# Altium schematic sheet 01_MPPT_controller.SchDoc
size 420 x 297 mm; Author: Shpakov Dmitry; Address1: Address1; Address2: Address2; Address3: Address3; Address4: Address4; DocumentNumber: АБВГ.123456.001 Э3; SheetNumber: 2; SheetTotal: 13; Scale: 1:1; DocumentType: Схема электрическая принципиальная; FirstReferrence: АБВГ.123456.001
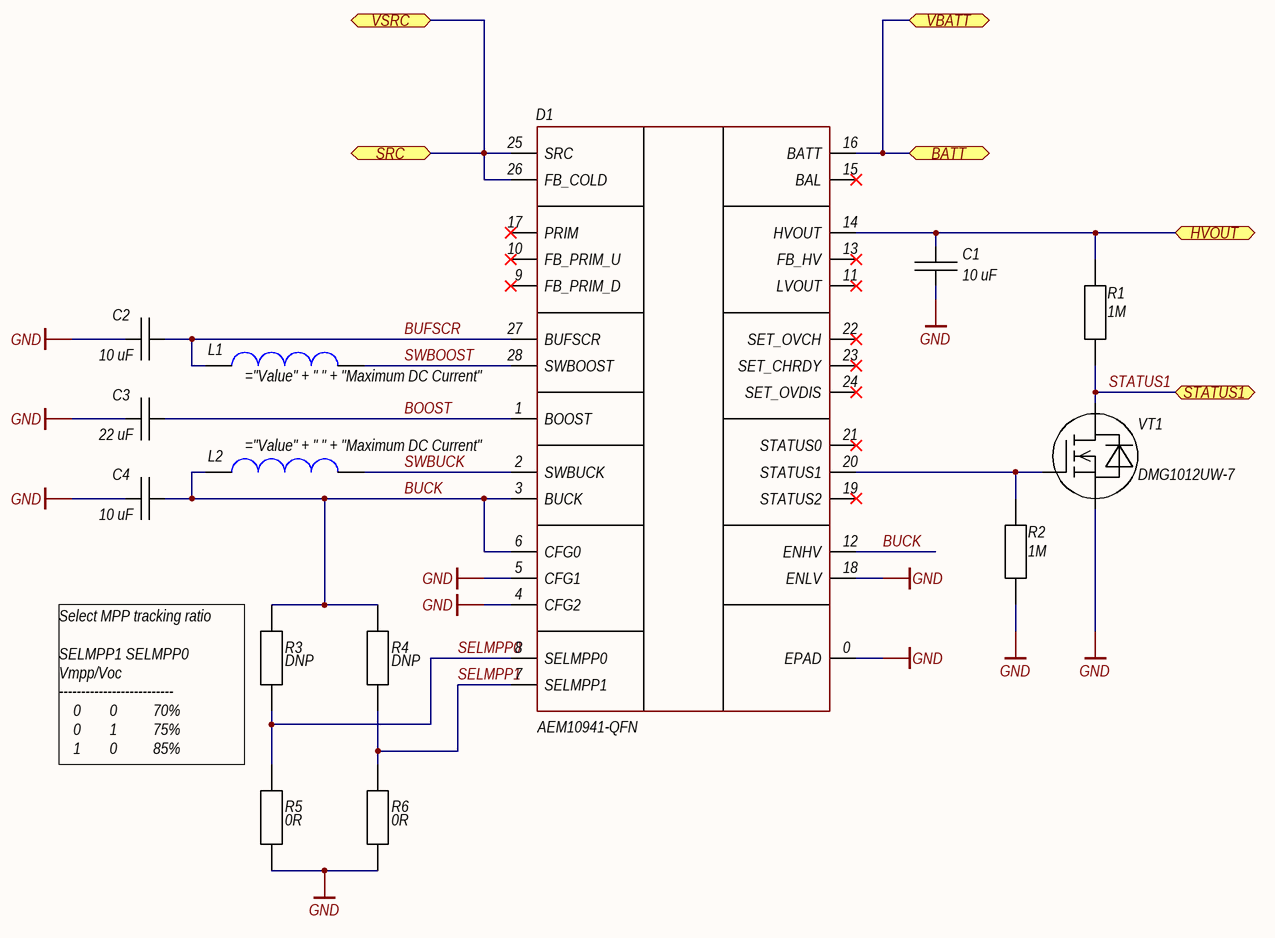
[diagram p0: 01_MPPT_controller.SchDoc]

## Parts
C1  10 uF  [CAPC1608X09N]
C2  10 uF  [CAPC1608X09N]
C3  22 uF  [CAPC1608X09N]
C4  10 uF  [CAPC1608X09N]
D1  PartNumber: AEM10941-QFN  [QFN50P500X500X85_HS-29N]
L1  (no value)  [INDP3939X11N]
L2  (no value)  [INDC1608X08N]
R1  1M  [RESC1608X05N]
R2  1M  [RESC1608X05N]
R3  DNP  [RESC1608X05N]
R4  DNP  [RESC1608X05N]
R5  0R  [RESC1608X05N]
R6  0R  [RESC1608X05N]
VT1  DMG1012UW-7  [SOT65P210X110-3N]

## Ports
BATT, HVOUT, SRC, STATUS1, VBATT, VSRC

## Nets
GND: C1.1 C2.1 C3.1 C4.1 D1.0(EPAD) D1.4(CFG2) D1.5(CFG1) D1.18(ENLV) R2.2 R5.1 R6.1 VT1.2(S)
BATT: D1.16(BATT) ; port VBATT, port BATT
BOOST: C3.2 D1.1(BOOST)
BUCK: C4.2 D1.3(BUCK) D1.6(CFG0) D1.12(ENHV) L2.1 R3.2 R4.2
BUFSCR: C2.2 D1.27(BUFSCR) L1.1
HVOUT: C1.2 D1.14(HVOUT) R1.1 ; port HVOUT
SELMPP0: D1.8(SELMPP0) R3.1 R5.2
SELMPP1: D1.7(SELMPP1) R4.1 R6.2
SRC: D1.25(SRC) D1.26(FB_COLD) ; port VSRC, port SRC
STATUS1: R1.2 VT1.3(D) ; port STATUS1
SWBOOST: D1.28(SWBOOST) L1.2
SWBUCK: D1.2(SWBUCK) L2.2
NetD1_20: D1.20(STATUS1) R2.1 VT1.1(G)

Not connected (* = marked no-connect by the designer): D1 9(FB_PRIM_D)* 10(FB_PRIM_U)* 11(LVOUT)* 13(FB_HV)* 15(BAL)* 17(PRIM)* 19(STATUS2)* 21(STATUS0)* 22(SET_OVCH)* 23(SET_CHRDY)* 24(SET_OVDIS)*

## Notes on the sheet
- Select MPP tracking ratio
  SELMPP1 SELMPP0 Vmpp/Voc
  --------------------------
  0        0          70%
  0        1          75%
  1        0          85%
  1        1          90%
- Author
- Manufacturer
- Date
- Page
- Total pages
- Size page
- A3
- Materials

## Library data of the parts
C1 C2 C4 = Ceramic: Ceramic capacitor; Manufacturer: Murata Electronics; PartNumber: GRM188R61A106ME69D; Power/Voltage: 10 VDC; Tolerance: 20 %; Operation Temperature: -55...+85; Note: X5R, General purpose; Help URL: https://eu.mouser.com/ProductDetail/Murata-Electronics/GRM188R61A106ME69D?qs=o98hbGm2QKGN31NsNZp5HQ%3D%3D; Type: ceramic capacitor; Value: 10 uF; Case: 0603
C3 = Ceramic: Ceramic capacitor; Manufacturer: Murata Electronics; PartNumber: GRM188R61A226ME15D; Power/Voltage: 10 VDC; Tolerance: 20 %; Operation Temperature: -55...+85; Note: X5R, General purpose; Help URL: https://eu.mouser.com/ProductDetail/Murata-Electronics/GRM188R61A226ME15D?qs=eeBpzGFlv%252B8DV%2FrilzyhAw%3D%3D; Type: ceramic capacitor; Value: 22 uF; Case: 0603
D1 = AEM10941-QFN28: Intergated energy management circuit that extracts DC power from up to 7-cell solar panels. With MPPT controller.; Manufacturer: e-peas; Type: PV energy harvester; Power/Voltage: 550mW; Operation Temperature: -40...+125 °C; Help URL: https://eu.mouser.com/ProductDetail/e-peas/AEM10941-QFN?qs=W%2FMpXkg%252BdQ7CeqB2lBPbRQ%3D%3D; Value: *; Tolerance: *; Note: *
L1 = Inductor: Manufacturer: Coilcraft; PartNumber: LPS4012-103MRB; Value: 10 uH; Tolerance: 20 %; Operation Temperature: -40...+85; Maximum DC Current: 750 mA; Maximum DC Resistance: 350 mOhm; Saturation Current: 1.1 A; Help URL: https://eu.mouser.com/ProductDetail/Coilcraft/LPS4012-103MRB?qs=QQJxVsr8EGamsM0letHvkQ%3D%3D; Power/Voltage: *; Type: inductor; Note: *; Case: 1515
L2 = Inductor: Manufacturer: TDK; PartNumber: MLZ1608M100WT000; Value: 10 uH; Tolerance: 20 %; Operation Temperature: -55...+125; Maximum DC Current: 250 mA; Maximum DC Resistance: 1.05 Ohm; Saturation Current: 90 mA; Help URL: https://eu.mouser.com/ProductDetail/TDK/MLZ1608M100WT000?qs=%2Fha2pyFaduj6%252B0RWY0sGlNh8Rxwgn4kiVfSaAvWnFwX0N61hyAW%252BjQ%3D%3D; Power/Voltage: *; Type: inductor; Note: *; Case: 0603
R1 R2 = resistor_smd: SMD resistor; Manufacturer: Yageo; PartNumber: RC0603JR-071ML; Power/Voltage: 1/10W; Tolerance: 5%; Operation Temperature: -55...+155; Note: Thick film; Help URL: https://www.digikey.com/en/products/detail/yageo/RC0603JR-071ML/726678; Type: resistor; Value: 1M; Case: 0603
R3-R6 = resistor_smd: SMD resistor; Manufacturer: Yageo; PartNumber: AC0603FR-070RL; Power/Voltage: 1/10 W, 75 V; Tolerance: 1 %; Operation Temperature: -55...+155; Help URL: https://eu.mouser.com/ProductDetail/Yageo/AC0603FR-070RL?qs=sGAEpiMZZMtlubZbdhIBIOG3KwTtqrl%2FD2D%252BGuMCfoY%3D; Type: resistor, Thick Film General Purpose; Case: 0603
  R3 R4: Value: DNP; Note: DNP
  R5 R6: Value: 0R
VT1 = DMF1012UW N-channel MOSFET: MOSFET DMG1012UW , N-channel, 20V, 1A; Manufacturer: Diodes Incorporated; Power/Voltage: 20V, 290mW; Type: MOSFET N-channel; Operation Temperature: -55...+150; PartNumber: DMG1012UW-7; Help URL: https://www.digikey.com/en/products/detail/diodes-incorporated/DMG1012UW-7/2183239?s=N4IgTCBcDaICYFsDmBGADCsBXA7iAugL5A; Value: *; Tolerance: *; Note: *; Case: SOT323